# EAGLE design HDJD-S822 Color Sensor Breakout-v1.0 (EAGLE 6.2)
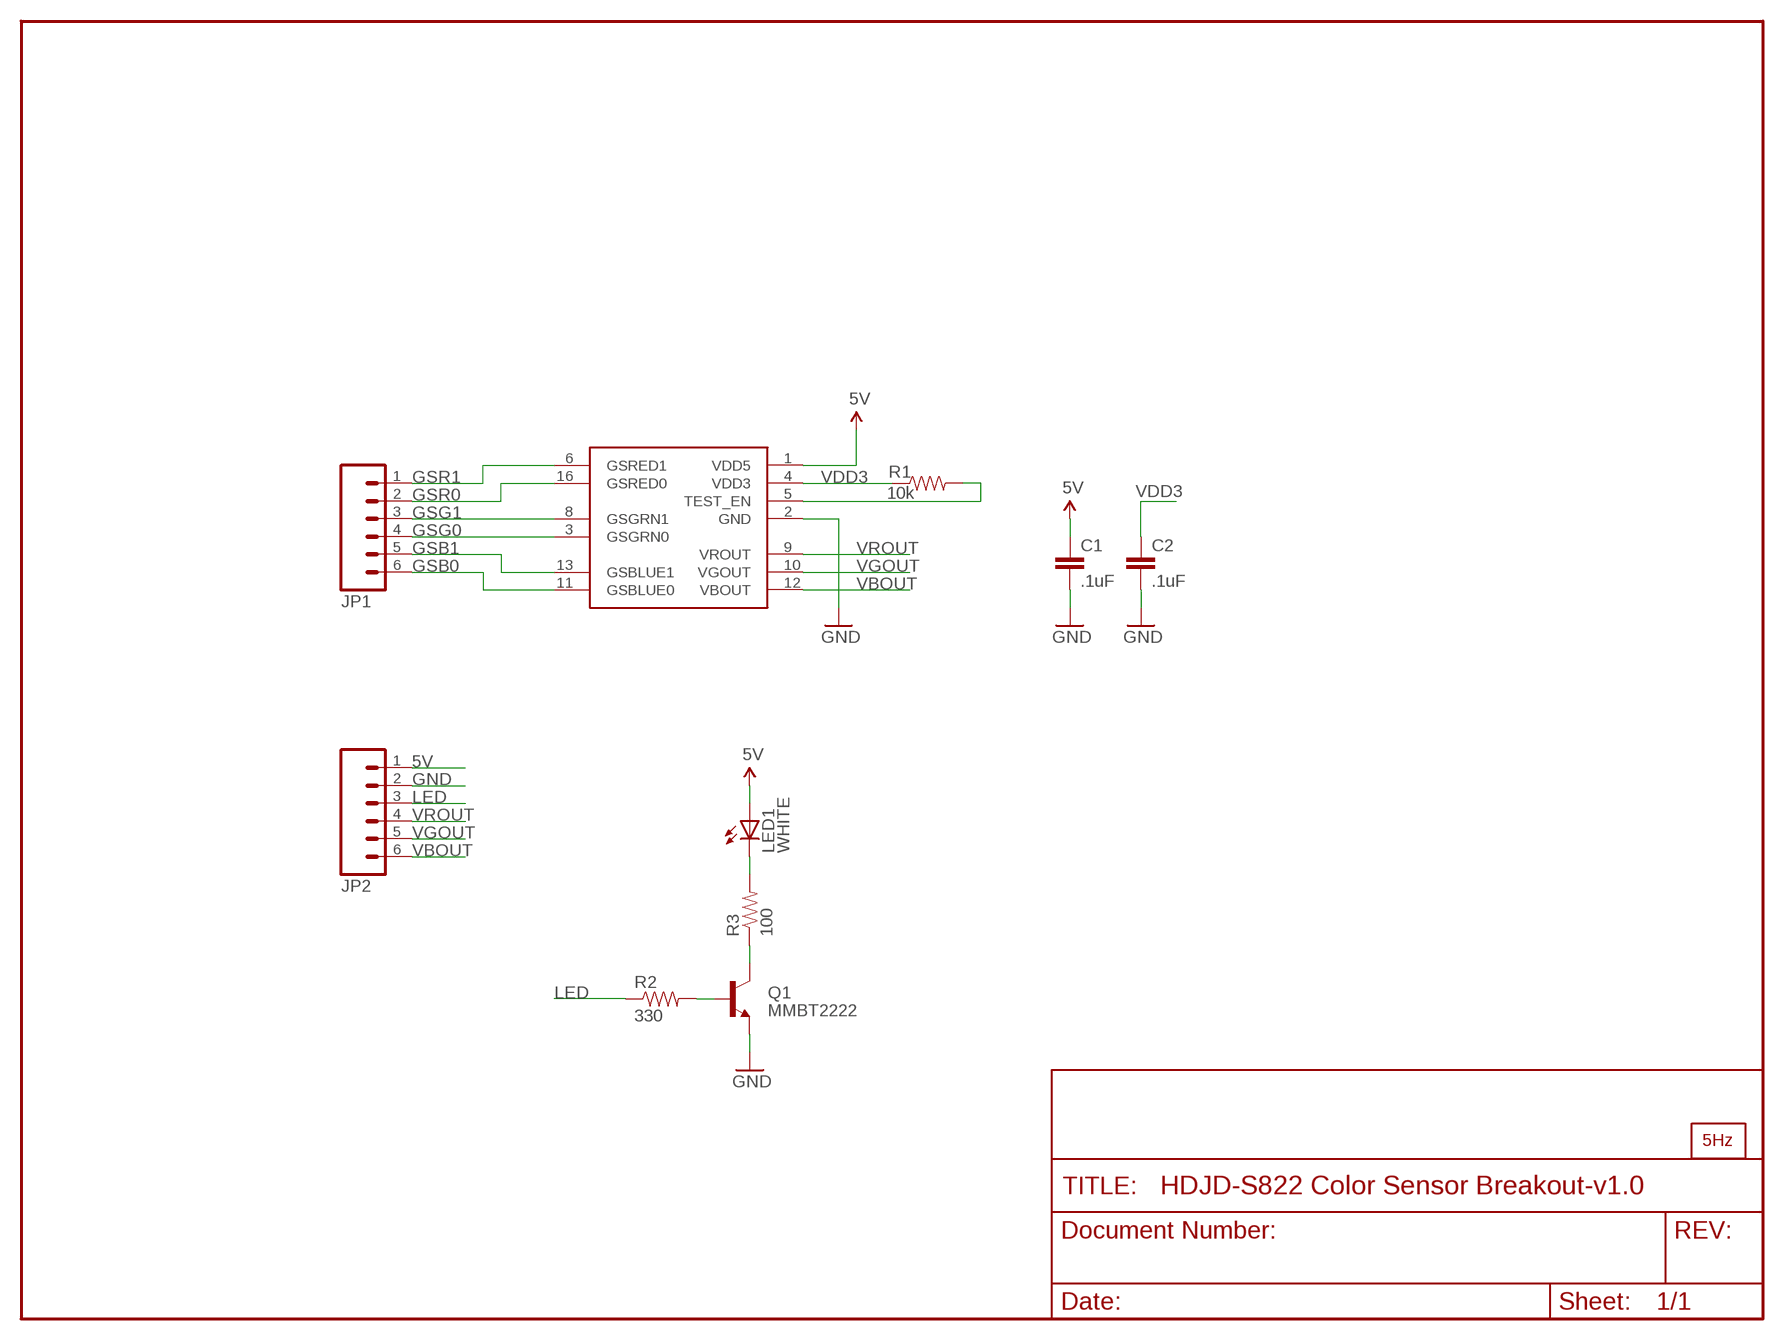
[diagram p0: schematic, sheet 1]

## Parts
C1  .1uF  CAP0402-CAP  [0402-CAP]
C2  .1uF  CAP0402-CAP  [0402-CAP]
JP1  M06SIP  [1X06]
JP2  M06SIP  [1X06]
LED1  WHITE  LED0603  [LED-0603]
Q1  MMBT2222  TRANSISTOR_NPNSOT23-3  [SOT23-3]
R1  10k  RESISTOR0402-RES  [0402-RES]
R2  330  RESISTOR0402-RES  [0402-RES]
R3  100  RESISTOR0402-RES  [0402-RES]
U$1  HDJD-S822-QR999ROUNDEDTHERMALPAD  [QFN-16-(ROUNDED0THERMAL-PAD)]
U$2  LOGO2_SILKL5MM  [LARGO2_5MM]

## Nets
5V: C1.1 JP2.1 LED1.A U$1.1(VDD5)
GND: C1.2 C2.2 JP2.2 Q1.2(E) U$1.2(GND)
GSB0: JP1.6 U$1.11(GSBLUE0)
GSB1: JP1.5 U$1.13(GSBLUE1)
GSG0: JP1.4 U$1.3(GSGRN0)
GSG1: JP1.3 U$1.8(GSGRN1)
GSR0: JP1.2 U$1.16(GSRED0)
GSR1: JP1.1 U$1.6(GSRED1)
LED: JP2.3 R2.1
N$1: LED1.C R3.2
N$2: R1.2 U$1.5(TEST_EN)
N$3: Q1.3(C) R3.1
N$4: Q1.1(B) R2.2
VBOUT: JP2.6 U$1.12(VBOUT)
VDD3: C2.1 R1.1 U$1.4(VDD3)
VGOUT: JP2.5 U$1.10(VGOUT)
VROUT: JP2.4 U$1.9(VROUT)

## Library data of the parts
C1 C2 = SparkFun:CAP: Capacitor Standard 0603 ceramic capacitor, and 0.1" leaded capacitor.
JP1 JP2 = SparkFun:M06: Header 6 Standard 6-pin 0.1" header. Use with straight break away headers (SKU : PRT-00116), right angle break away headers (PRT-00553), swiss pins (PRT-00743), machine pins (PRT-00117), and female headers (PRT-00115). Molex polarized connector foot print use with SKU : PRT-08094 with associated crimp pins and housings. NOTES ON THE VARIANTS LOCK and LOCK_LONGPADS... This footprint was designed to help hold the alignment of a through-hole component (i.e. 6-pin header) while soldering it into place. You may notice that each hole has been shifted either up or down by 0.005 of an inch from it's more standard position (which is a perfectly straight line). This slight alteration caused the pins (the squares in the middle) to touch the edges of the holes. Because they are alternating, it causes a "brace" to hold the component in place. 0.005 has proven to be the perfect amount of "off-center" position when using our standard breakaway headers. Although looks a little odd when you look at the bare footprint, once you have a header in there, the alteration is very hard to notice. Also, if you push a header all the way into place, it is covered up entirely on the bottom side. This idea of altering the position of holes to aid alignment will be further integrated into the Sparkfun Library for other footprints. It can help hold any component with 3 or more connection pins.
LED1 = SparkFun:LED: LEDs Standard schematic elements and footprints for 5mm, 3mm, 1206, and 0603 sized LEDs. 5mm - Spark Fun Electronics SKU : COM-00529 (and others)
Q1 = SparkFun:TRANSISTOR_NPN: Transistor NPN BJT configuration in SOT23 package. MMBT2222 is the common NPN we use. Double check BCE configuration again layout.
R1-R3 = SparkFun:RESISTOR: Resistor Basic schematic elements and footprints for 0603, 1206, and PTH resistors.
U$1 = Testing:HDJD-S822-QR999
U$2 = LOGO:LOGO2_SILK: PRINCIPAL

## Board
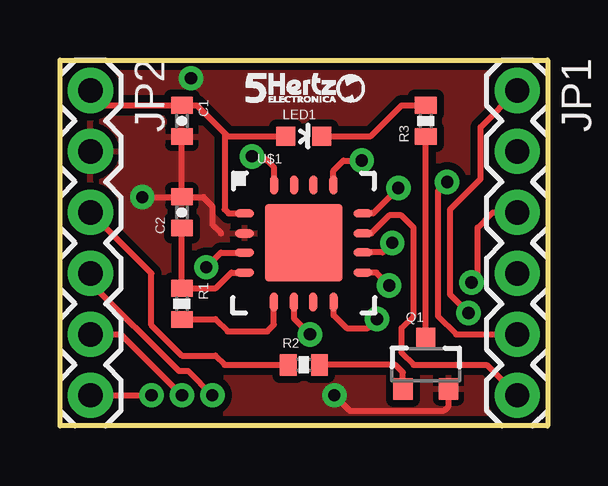
[diagram p1: board, top side]
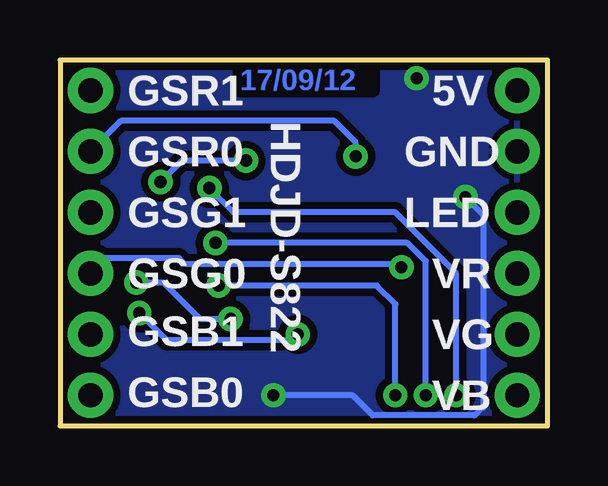
[diagram p2: board, bottom side, seen from below]

Size 20.32 x 15.24 mm. Coordinates in mm from the lower left corner, seen from the top.
Outline: 0,0 0,15.24 20.32,15.24 20.32,0 0,0
Copper layers (1*16): Top 0.035mm / dielectric 1.5mm / Bottom 0.035mm
Design rules: minimum track width 8mil, minimum drill 20mil, track to track 8mil, track to pad 8mil, pad to pad 8mil, via to via 8mil, smd to smd 8mil, copper to edge 8mil, drill to drill 8mil, minimum pad ring 12mil, minimum via ring 10mil, stop-mask expansion 4mil, vias tented up to drill 20mil, thermal gap 10mil

### Footprints (pad centres in the part's own frame; a part is rotated, then mirrored left to right if it is on the bottom)
0402-CAP = smd 0.7 x 0.9: 1 -0.65,0; 2 0.65,0
1X06 = drill 1.016 pad 1.88: 1 0,0; 2 2.54,0; 3 5.08,0; 4 7.62,0; 5 10.16,0; 6 12.7,0
LED-0603 = smd 0.8 x 0.8: A 0,-0.75; C 0,0.75
SOT23-3 = smd 0.8 x 0.9: 1 -0.95,-1; 2 0.95,-1; 3 0,1.1
0402-RES = smd 0.7 x 0.9: 1 -0.65,0; 2 0.65,0
QFN-16-(ROUNDED0THERMAL-PAD) = smd 0.8 x 0.343: 1 -2.464,1.225; 2 -2.467,0.391; 3 -2.467,-0.409; 4 -2.467,-1.243; 9 2.458,-1.241; 10 2.463,-0.4; 11 2.463,0.4; 12 2.467,1.232 | smd 0.343 x 0.8: 5 -1.247,-2.464; 6 -0.411,-2.466; 7 0.389,-2.466; 8 1.239,-2.472; 13 1.233,2.421; 14 0.396,2.418; 15 -0.404,2.418; 16 -1.236,2.418 | smd 3.23 x 3.23: EXP 0,0

### Placement (x,y rotation side)
C1  5.08,12.7 270 top
C2  5.08,8.89 90 top
JP1  19.05,13.97 270 top
JP2  1.27,13.97 270 top
LED1  10.16,12.06 270 top
Q1  15.24,2.54 0 top
R1  5.08,5.08 270 top
R2  10.16,2.54 0 top
R3  15.24,12.7 90 top
U$1  10.16,7.62 0 top
U$2  7.75,13.46 0 top

### Tracks (layer width: path | path; a pad name or v marks a point on that pad's centre or on a via)
5V
  Top 0.254: JP2.1 1.89,13.35 C1.1 5.7,13.35 6.86,12.19 | 6.86,12.19 6.99,12.06 LED1.A | U$1.1 7.03,8.85 6.86,9.02 6.86,12.19
GND  (via drill 0.51)
  Top 0.254: 5.07,12.06 C1.2 C2.2 | 6.71,8.02 6.35,8.38 6.35,9.14 5.97,9.53 5.09,9.53 C2.2 | 16.19,1.59 Q1.2 16.19,0.82 16,0.64 12.06,0.64 v11.43,1.27 | v3.43,9.53 5.07,9.53 C2.2
  Bottom 0.254: v3.43,9.53 2.67,8.76 2.67,0.76 2.72,0.76 3.05,0.43 7.29,0.43 8.13,1.27 v11.43,1.27
  other vias: 5.46,14.48
  pour Bottom (isolate 0.305): 0,15.24 20.32,15.24 20.32,0 0,0
  pour Top (isolate 0.305): 0,15.24 20.32,15.24 20.32,0 0,0
GSB0
  Top 0.254: JP1.6 17.78,2.54 14.73,2.54 14.22,3.05 14.22,4.06 14.73,4.57 14.73,8.26 14.22,8.76 13.72,8.76 12.97,8.02 U$1.11
GSB1  (via drill 0.51)
  Top 0.254: v12.57,11.05 11.81,11.05 11.39,10.63 U$1.13 | v16.13,10.16 15.75,9.78 15.75,4.57 16.51,3.81 JP1.5
  Bottom 0.254: v12.57,11.05 15.24,11.05 v16.13,10.16
GSG0  (via drill 0.51)
  Top 0.254: U$1.3 6.7,7.21 v6.1,6.6
  Bottom 0.254: JP1.4 18.41,6.99 15.37,6.99 15.11,6.73 6.22,6.73 v6.1,6.6
GSG1  (via drill 0.51)
  Top 0.254: v13.21,4.45 12.83,4.06 11.94,4.06 11.4,4.6 U$1.8 | JP1.3 18.03,8.89 17.4,8.26 17.4,6.22 v17.14,5.97
  Bottom 0.254: v17.14,5.97 16,5.97 14.48,4.45 v13.21,4.45
GSR0  (via drill 0.51)
  Top 0.254: U$1.16 8.92,10.76 8.46,11.23 v8,11.23
  Bottom 0.254: JP1.2 17.78,12.7 8.89,12.7 8,11.81 v8,11.23
GSR1  (via drill 0.51)
  Top 0.254: v10.41,3.81 9.76,4.46 U$1.6 | v17.02,4.7 16.26,5.46 16.26,9.02 17.53,10.29 17.53,12.45 JP1.1
  Bottom 0.254: v10.41,3.81 10.67,3.56 15.88,3.56 v17.02,4.7
LED
  Top 0.254: JP2.3 3.81,6.35 3.81,4.19 5.08,2.92 6.48,2.92 6.86,2.54 R2.1
N$1
  Top 0.254: LED1.C 12.95,12.06 14.24,13.35 R3.2
N$2
  Top 0.254: U$1.5 8.91,4.21 8.64,3.94 6.99,3.94 6.48,4.45 5.09,4.45 R1.2
N$3
  Top 0.254: Q1.3 R3.1
N$4
  Top 0.254: Q1.1 14.29,2.22 13.97,2.54 R2.2
VBOUT  (via drill 0.51)
  Top 0.254: JP2.6 v3.81,1.27 | U$1.12 13.04,8.85 v14.1,9.91
  Bottom 0.254: v3.81,1.27 3.81,6.35 6.35,8.89 13.08,8.89 v14.1,9.91
VDD3
  Top 0.254: R1.1 C2.1 | R1.1 5.09,5.71 | U$1.4 7.14,6.38 6.49,5.73 R1.1
VGOUT  (via drill 0.51)
  Top 0.254: v5.08,1.27 2.54,3.81 JP2.5 | v13.84,7.62 13.44,7.22 U$1.10
  Bottom 0.254: v13.84,7.62 5.84,7.62 5.08,6.86 v5.08,1.27
VROUT  (via drill 0.51)
  Top 0.254: JP2.4 1.27,5.97 4.95,2.29 5.33,2.29 v6.35,1.27 | U$1.9 13.18,6.38 v13.72,5.84
  Bottom 0.254: v6.35,1.27 6.35,5.08 7.11,5.84 v13.72,5.84

### Text on the board
Bottom: 17/09/12
bPlace: 5V | HDJD-S822 | GSR1 | GND | GSR0 | LED | GSG1 | VR | GSG0 | VG | GSB1 | VB | GSB0
tValues: Jordan McConnell